# Altium project ESP32S3 controller.PrjPcb
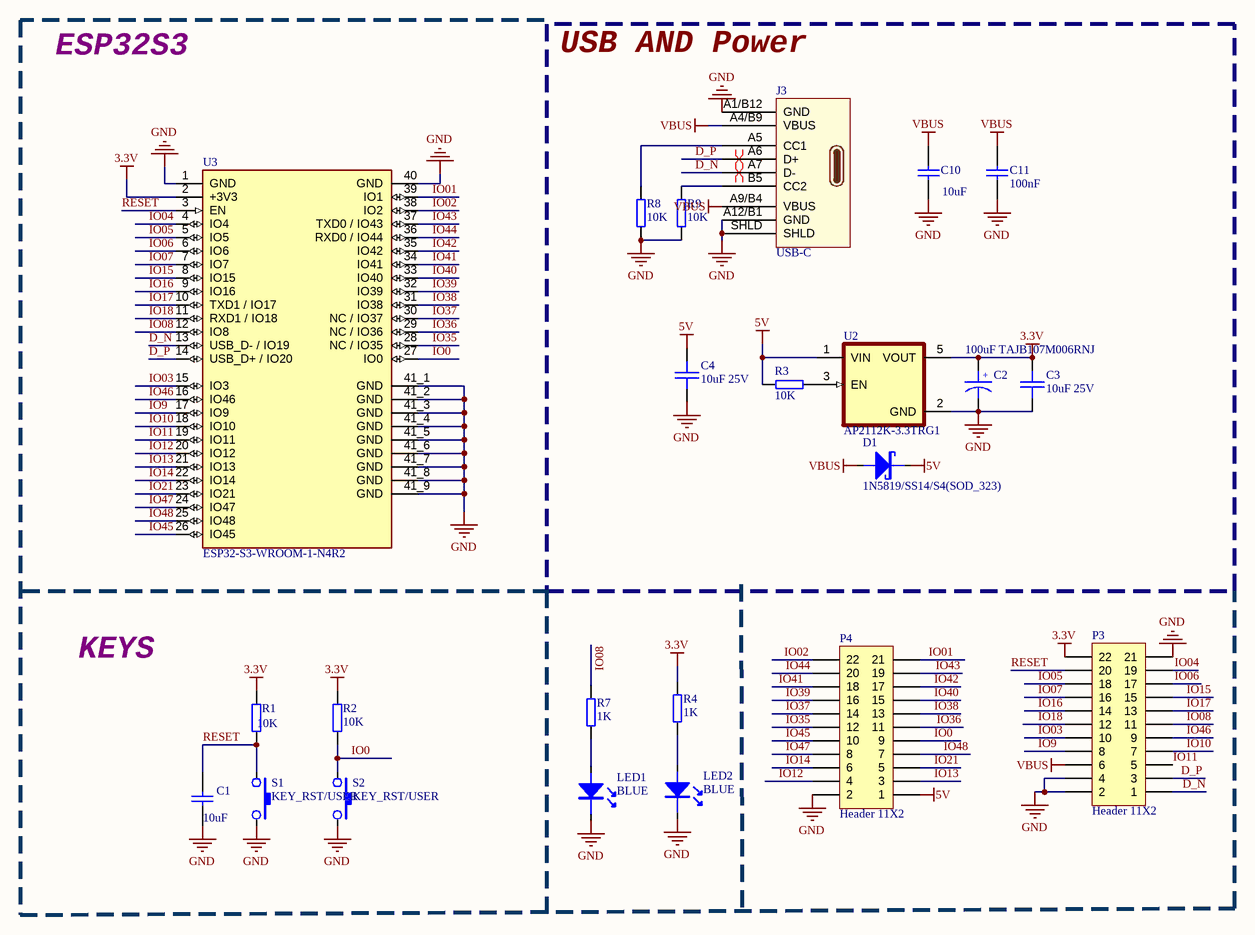
[diagram p0: Controller_sch.SchDoc]
1 sheet, 23 parts. Net scope: global (net labels, ports and power ports of the same name join across sheets).
Board file: Controller_layout_typeC.PcbDoc

## Sheet Controller_sch.SchDoc
size 431 x 279 mm

### Parts
C1  value 10uF  [CAPC1608X90N]  (hidden comment: Cap Semi)
C2  100uF TAJB107M006RNJ  [SMT_C_Tantalum_B]
C3  10uF 25V  [CAPC2012X135N]
C4  10uF 25V  [CAPC2012X135N]
C10  value 10uF  [CAPC1608X90N]  (hidden comment: Cap Semi)
C11  value 100nF  [CAPC1608X90N]  (hidden comment: Cap Semi)
D1  1N5819/SS14/S4(SOD_323)  [SMT_DIODE_SOD_323]
J3  USB-C  [USB-C 8p]
LED1  BLUE  [SMT_LED_0603]
LED2  BLUE  [SMT_LED_0603]
P3  Header 11X2  [HDR2X11]
P4  Header 11X2  [HDR2X11]
R1  value 10K  [RESC1608N_ZERO]  (hidden comment: Resistor)
R2  value 10K  [RESC1608N_ZERO]  (hidden comment: Resistor)
R3  value 10K  [RESC1608N_ZERO]  (hidden comment: Resistor)
R4  value 1K  [RESC1608N_ZERO]  (hidden comment: Resistor)
R7  value 1K  [RESC1608N_ZERO]  (hidden comment: Resistor)
R8  value 10K  [RESC1608N_ZERO]  (hidden comment: Resistor)
R9  value 10K  [RESC1608N_ZERO]  (hidden comment: Resistor)
S1  KEY_RST/USER  [SMT_SW_PTS_820]
S2  KEY_RST/USER  [SMT_SW_PTS_820]
U2  AP2112K-3.3TRG1  [SOT23-5]
U3  ESP32-S3-WROOM-1-N4R2  [ESP32-S3-WROOM-1_NO-KEEPOUT]

### Blocks framed on the sheet
USB AND Power: C2-C4 C10 C11 D1 J3 R3 R8 R9 U2

### Nets
3.3V: C2.1 C3.1 P3.22 R1.2 R2.2 R4.1 U2.5(VOUT) U3.2(+3V3)
5V: C4.1 D1.2(K) P4.1 R3.2 U2.1(VIN)
GND: C1.1 C2.2 C3.2 C4.2 C10.1 C11.2 J3.A1/B12(GND) J3.A12/B1(GND) J3.SHLD LED1.2(K) LED2.2(K) P3.2 P3.4 P3.21 P4.2 R8.1 R9.2 S1.2 S2.2 U2.2(GND) U3.1(GND) U3.40(GND) U3.41_1(GND) U3.41_2(GND) U3.41_3(GND) U3.41_4(GND) U3.41_5(GND) U3.41_6(GND) U3.41_7(GND) U3.41_8(GND) U3.41_9(GND)
VBUS: C10.2 C11.1 D1.1(A) J3.A4/B9(VBUS) J3.A9/B4(VBUS) P3.6
D_N: J3.A7(D-) P3.1 U3.13(USB_D-_/_IO19)
D_P: J3.A6(D+) P3.3 U3.14(USB_D+_/_IO20)
IO0: P4.9 R2.1 S2.1 U3.27(IO0)
IO01: P4.21 U3.39(IO1)
IO02: P4.22 U3.38(IO2)
IO03: P3.10 U3.15(IO3)
IO04: P3.19 U3.4(IO4)
IO05: P3.18 U3.5(IO5)
IO06: P3.17 U3.6(IO6)
IO07: P3.16 U3.7(IO7)
IO08: P3.11 R7.1 U3.12(IO8)
IO9: P3.8 U3.17(IO9)
IO10: P3.7 U3.18(IO10)
IO11: P3.5 U3.19(IO11)
IO12: P4.4 U3.20(IO12)
IO13: P4.3 U3.21(IO13)
IO14: P4.6 U3.22(IO14)
IO15: P3.15 U3.8(IO15)
IO16: P3.14 U3.9(IO16)
IO17: P3.13 U3.10(TXD1_/_IO17)
IO18: P3.12 U3.11(RXD1_/_IO18)
IO21: P4.5 U3.23(IO21)
IO35: P4.12 U3.28(NC_/_IO35)
IO36: P4.11 U3.29(NC_/_IO36)
IO37: P4.14 U3.30(NC_/_IO37)
IO38: P4.13 U3.31(IO38)
IO39: P4.16 U3.32(IO39)
IO40: P4.15 U3.33(IO40)
IO41: P4.18 U3.34(IO41)
IO42: P4.17 U3.35(IO42)
IO43: P4.19 U3.37(TXD0_/_IO43)
IO44: P4.20 U3.36(RXD0_/_IO44)
IO45: P4.10 U3.26(IO45)
IO46: P3.9 U3.16(IO46)
IO47: P4.8 U3.24(IO47)
IO48: P4.7 U3.25(IO48)
RESET: C1.2 P3.20 R1.1 S1.1 U3.3(EN)
NetJ3_A5: J3.A5(CC1) R8.2
NetJ3_B5: J3.B5(CC2) R9.1
NetLED1_1: LED1.1(A) R7.2
NetLED2_1: LED2.1(A) R4.2
NetR3_1: R3.1 U2.3(EN)

### Layout directives
differential pair: D_N, D_P

### Notes on the sheet
- ESP32S3
- KEYS
- DWG. NO.
- REV.
- SHT.
- THIS DOCUMENT AND THE DATA DISCLOSED HEREIN OR HEREWITH IS THE PROPERTY OF ALTIUM LIMITED AND MAY BE FREELY DISTRIBUTED IN WHOLE. NO RIGHTS ARE RESERVED OR EXPRESS OR IMPLIED WARANTEE GIVEN.
- REVISION
- DESCRIPTION
- DATE
- APPROVED
- ENG:
- APPROVALS
- PROJECT
- DSN:
- CHK:
- REFERENCE DOCUMENTS
- PROJECT REVISION:
- TITLE
- DOCUMENT REVISION:
- DESIGN ITEM:
- BOM:
- FAB DWG:
- PCB DWG:
- ASSY DWG:
- SCALE:
- SIZE
- B
- CAGE CODE
- FILE NAME
- DWG NO.
- SHEET
- OF
- REV
- (in symbol SMT_C_Tantalum_B) +

### Library data of the parts
C1 C10 = CAP-SM-0603-X5R-10uF: CAP SM 0603 X5R 10uF 10%; Tolerance: ±10%; Supplier 1: Farnell; Supplier 2: Digi-Key; Supplier Part Number 1: 2366833; Supplier Part Number 2: 490-3896-1-ND
C2 = SMT_C_Tantalum_B: Capacitor, SM Tantalum; Body 3.5 x 2.8 mm (LxW typ)
C3 C4 = SMT_C_0805: Surface mount capacitor 0805
C11 = CAP-SM-0603-X7R-100nF: CAP SM 0603 X7R 100nF 10%; Tolerance: ±10%; Supplier 1: Digi-Key; Supplier 2: Farnell; Supplier Part Number 1: 490-3167-1-ND; Supplier Part Number 2: 1775994RL
D1 = SMT_DIODE_SCHOTTKY_SOD_323: Surface mount schottky diode SOD-323(0805) Package
LED1 LED2 = SMT_LED_0603: SMT LED
P3 P4 = Header 11X2: Header, 11-Pin, Dual row; LatestRevisionDate: 17-Jul-2002; LatestRevisionNote: Re-released for DXP Platform.; Publisher: Altium Limited
R1-R3 R8 R9 = RES-SM-0603-10K: RES SM 0603 10K; Supplier 1: Farnell; Supplier 2: Digi-Key; Supplier Part Number 1: 9330399; Supplier Part Number 2: 541-10.0KHCT-ND
R4 R7 = RES-SM-0603-1K: RES SM 0603 1K
S1 S2 = SMT_SW_PTS_820: SMT Tactile ‎Switch PTS 820 Series
U2 = AP2112K-3.3TRG1: Linear Voltage Regulator IC 1 Output 600mA SOT-25; MF: Diodes Inc.; Digi-Key_Part_Number: AP2112K-3.3TRG1DICT-ND; SnapEDA_Link: https://www.snapeda.com/parts/AP2112K-3.3TRG1/Diodes%20Inc./view-part/454988/?ref=snap; Package: SOT-753 Diodes Inc.; MP: AP2112K-3.3TRG1; Value: *; Digi-Key_Purchase_URL: https://www.digikey.com.au/product-detail/en/diodes-incorporated/AP2112K-3.3TRG1/AP2112K-3.3TRG1DICT-ND/4505257?utm_source=snapeda&utm_medium=aggregator&utm_campaign=symbol
U3 = ESP32-S3-WROOM-1: Multiprotocol Modules SMD Module, ESP32-S3R8, 3.3V, 8 MB Octal PSRAM Die, 16 MB Quad SPI Flash, PCB Antenna; MPN: ESP32-S3-WROOM-1-N16R2; MF: Espressif Systems; Supplier Link: https://www.digikey.com/en/products/detail/espressif-systems/ESP32-S3-WROOM-1-N16R2/16162644; Package: Module Espressif Systems; Value: *; Digi-Key_Part_Number: 1965-ESP32-S3-WROOM-1-N16R2TR-ND; Check_prices: https://www.snapeda.com/parts/ESP32-WROOM-32/Espressif+Systems/view-part/?ref=eda; SnapEDA_Link: https://www.snapeda.com/parts/ESP32-WROOM-32/Espressif+Systems/view-part/?ref=snap; Price: 3.98; Supplier: Digikey